# EAGLE design midi_to_cv (EAGLE 7.1.0)
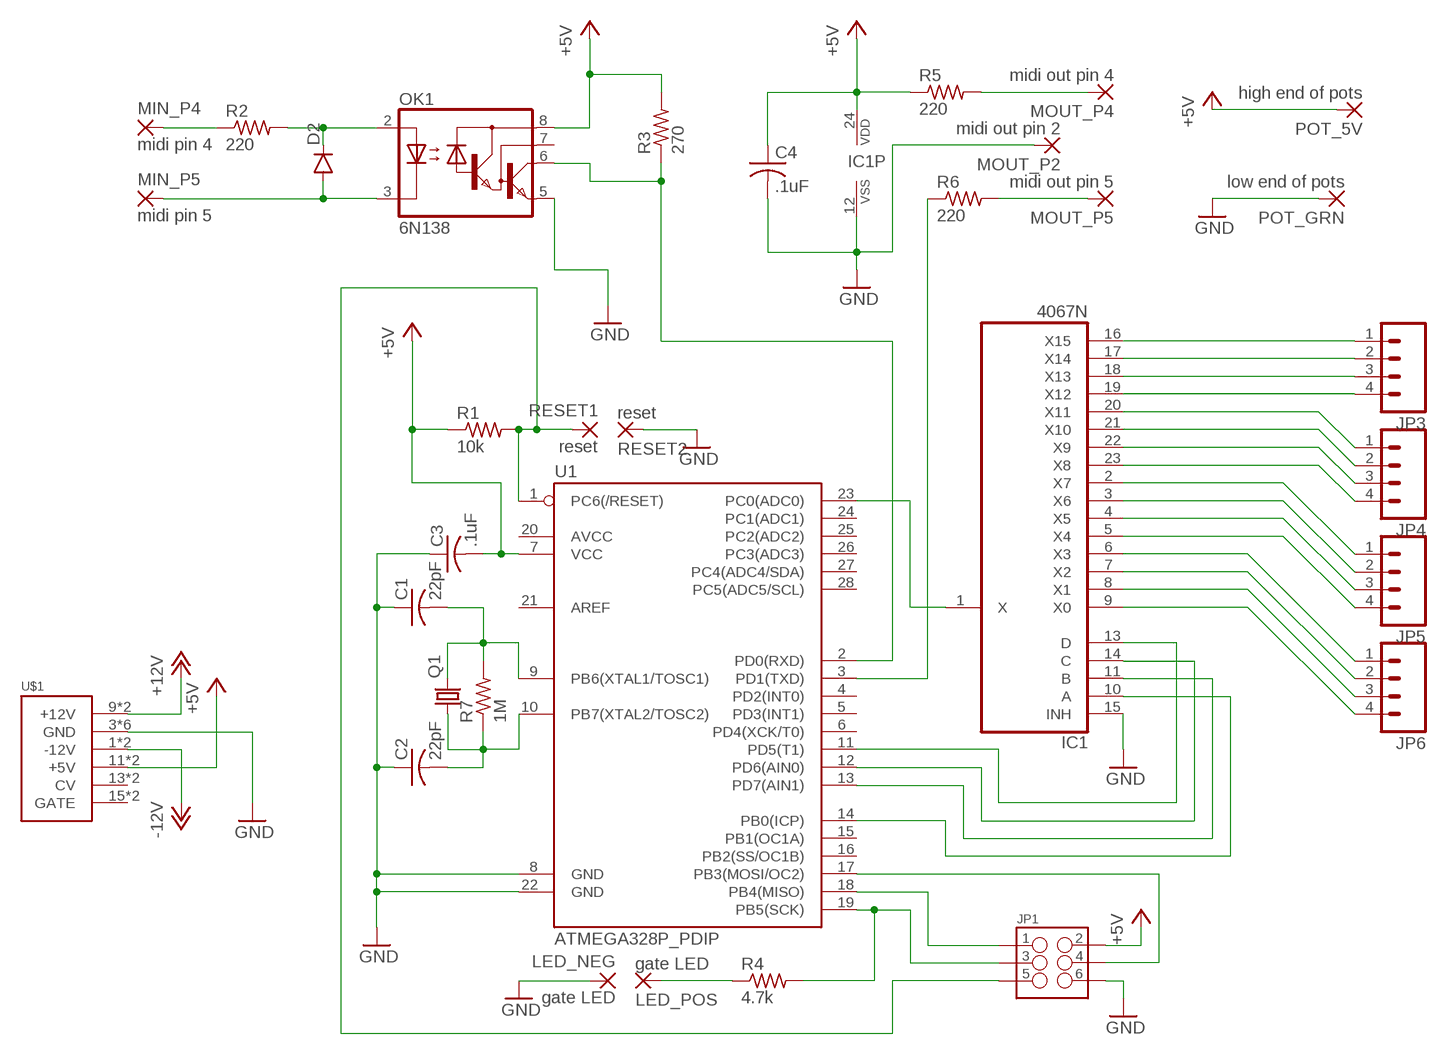
[diagram p0: schematic, sheet 1]

## Parts
C1  22pF  C-US025-040X050  [C025-040X050]
C2  22pF  C-US025-040X050  [C025-040X050]
C3  .1uF  C-US025-040X050  [C025-040X050]
C4  .1uF  C-US025-040X050  [C025-040X050]
D2  DIODE1N4148  [DIODE-1N4148]
IC1  4067N  [DIL24-6]
JP1  M03X2NO_SILK  [2X3-NS]
JP3  M04LONGPADS  [1X04_LONGPADS]
JP4  M04LONGPADS  [1X04_LONGPADS]
JP5  M04LONGPADS  [1X04_LONGPADS]
JP6  M04LONGPADS  [1X04_LONGPADS]
LED_NEG  gate LED  2,54/0,9  [2,54/0,9]
LED_POS  gate LED  2,54/0,9  [2,54/0,9]
MIN_P4  midi pin 4  2,54/0,9  [2,54/0,9]
MIN_P5  midi pin 5  2,54/0,9  [2,54/0,9]
MOUT_P2  midi out pin 2  2,54/0,9  [2,54/0,9]
MOUT_P4  midi out pin 4  2,54/0,9  [2,54/0,9]
MOUT_P5  midi out pin 5  2,54/0,9  [2,54/0,9]
OK1  6N138  [DIL08]
POT_5V  high end of pots  2,54/0,9  [2,54/0,9]
POT_GRN  low end of pots  2,54/0,9  [2,54/0,9]
Q1  CRYSTALHC49U-V  [HC49U-V]
R1  10k  R-US_0207/10  [0207/10]
R2  220  R-US_0207/10  [0207/10]
R3  270  R-US_0207/10  [0207/10]
R4  4.7k  R-US_0207/10  [0207/10]
R5  220  R-US_0207/10  [0207/10]
R6  220  R-US_0207/10  [0207/10]
R7  1M  R-US_0207/10  [0207/10]
RESET1  reset  2,54/0,9  [2,54/0,9]
RESET2  reset  2,54/0,9  [2,54/0,9]
U1  ATMEGA328P_PDIP  [DIL28-3]
U$1  POWER  [POWER_16]

## Nets
+5V: C3.2 C4.1 IC1.24(VDD) JP1.2 OK1.8(VCC) POT_5V.1(P) R1.1 R3.2 R5.1 U1.7(VCC) U$1.11(+5V) U$1.12(+5V)
+12V: U$1.9(+12V) U$1.10(+12V)
-12V: U$1.1(-12V) U$1.2(-12V)
GND: C1.1 C2.1 C3.1 C4.2 IC1.12(VSS) IC1.15(INH) JP1.6 LED_NEG.1(P) MOUT_P2.1(P) OK1.5(GND) POT_GRN.1(P) RESET2.1(P) U1.8(GND) U1.22(GND) U$1.3(GND) U$1.4(GND) U$1.5(GND) U$1.6(GND) U$1.7(GND) U$1.8(GND)
N$1: JP1.5 R1.2 RESET1.1(P) U1.1(PC6(/RESET))
N$2: IC1.9(X0) JP6.4
N$3: IC1.8(X1) JP6.3
N$4: C1.2 Q1.2 R7.2 U1.9(PB6(XTAL1/TOSC1))
N$5: C2.2 Q1.1 R7.1 U1.10(PB7(XTAL2/TOSC2))
N$6: MOUT_P5.1(P) R6.2
N$7: IC1.7(X2) JP6.2
N$8: IC1.6(X3) JP6.1
N$9: IC1.13(D) U1.11(PD5(T1))
N$10: JP1.3 R4.2 U1.19(PB5(SCK))
N$11: LED_POS.1(P) R4.1
N$12: IC1.14(C) U1.12(PD6(AIN0))
N$13: IC1.11(B) U1.13(PD7(AIN1))
N$14: IC1.10(A) U1.14(PB0(ICP))
N$15: IC1.5(X4) JP5.4
N$16: R6.1 U1.3(PD1(TXD))
N$17: IC1.4(X5) JP5.3
N$18: IC1.1(X) U1.23(PC0(ADC0))
N$19: IC1.3(X6) JP5.2
N$20: IC1.2(X7) JP5.1
N$21: IC1.23(X8) JP4.4
N$22: IC1.22(X9) JP4.3
N$23: IC1.21(X10) JP4.2
N$24: IC1.20(X11) JP4.1
N$25: IC1.19(X12) JP3.4
N$26: IC1.18(X13) JP3.3
N$27: IC1.17(X14) JP3.2
N$28: IC1.16(X15) JP3.1
N$29: D2.A MIN_P5.1(P) OK1.3(C)
N$30: D2.C OK1.2(A) R2.2
N$31: MIN_P4.1(P) R2.1
N$32: OK1.6(VO) R3.1 U1.2(PD0(RXD))
N$33: MOUT_P4.1(P) R5.2
N$34: JP1.4 U1.17(PB3(MOSI/OC2))
N$36: JP1.1 U1.18(PB4(MISO))
Unconnected: OK1.7(VB) U1.4(PD2(INT0)) U1.5(PD3(INT1)) U1.6(PD4(XCK/T0)) U1.15(PB1(OC1A)) U1.16(PB2(SS/OC1B)) U1.20(AVCC) U1.21(AREF) U1.24(PC1(ADC1)) U1.25(PC2(ADC2)) U1.26(PC3(ADC3)) U1.27(PC4(ADC4/SDA)) U1.28(PC5(ADC5/SCL)) U$1.13(CV) U$1.14(CV) U$1.15(GATE) U$1.16(GATE)

## Library data of the parts
C1-C4 = rcl:C-US: CAPACITOR, American symbol
D2 = SparkFun-DiscreteSemi:DIODE: Diode These are standard reverse protection diodes and small signal diodes. SMA package can handle up to about 1A. SOD-323 can handle about 200mA. What the SOD-323 package when ordering, there are some mfgs out there that are 5-pin packages.
IC1 = 40xx:4067: 16-channel ANALOG MULTIPLEXER
JP1 = SparkFun-Connectors:M03X2: 2x3 .1" header. Shrouded, with keying- CONN-10681 SMT- CONN-11415 Pogo pins- HW-11044
JP3-JP6 = SparkFun-Connectors:M04: Header 4 Standard 4-pin 0.1" header. Use with straight break away headers (SKU : PRT-00116), right angle break away headers (PRT-00553), swiss pins (PRT-00743), machine pins (PRT-00117), and female headers (PRT-00115). Molex polarized connector foot print use with SKU : PRT-08231 with associated crimp pins and housings. 1MM SMD Version SKU: PRT-10208
LED_NEG LED_POS MIN_P4 MIN_P5 MOUT_P2 MOUT_P4 MOUT_P5 POT_5V POT_GRN RESET1 RESET2 = wirepad:2,54/0,9: THROUGH-HOLE PAD
OK1 = optocoupler:6N138: MOTOROLA OPTO COUPLER; MF: VISHAY/TELEFUNKEN; MPN: 6N138; OC_FARNELL: 9860150; OC_NEWARK: 35K5294
Q1 = crystal:CRYSTAL: CRYSTAL; OC_FARNELL: 1666969; OC_NEWARK: unknown
R1-R7 = rcl:R-US_: RESISTOR, American symbol
U1 = SparkFun-DigitalIC:ATMEGA328P_PDIP: uC used in the Arduino 32kb flash, 1k EEPROM, 2k SRAM This is the through-hole version of this chip.
U$1 = eurorack:POWER

## Board
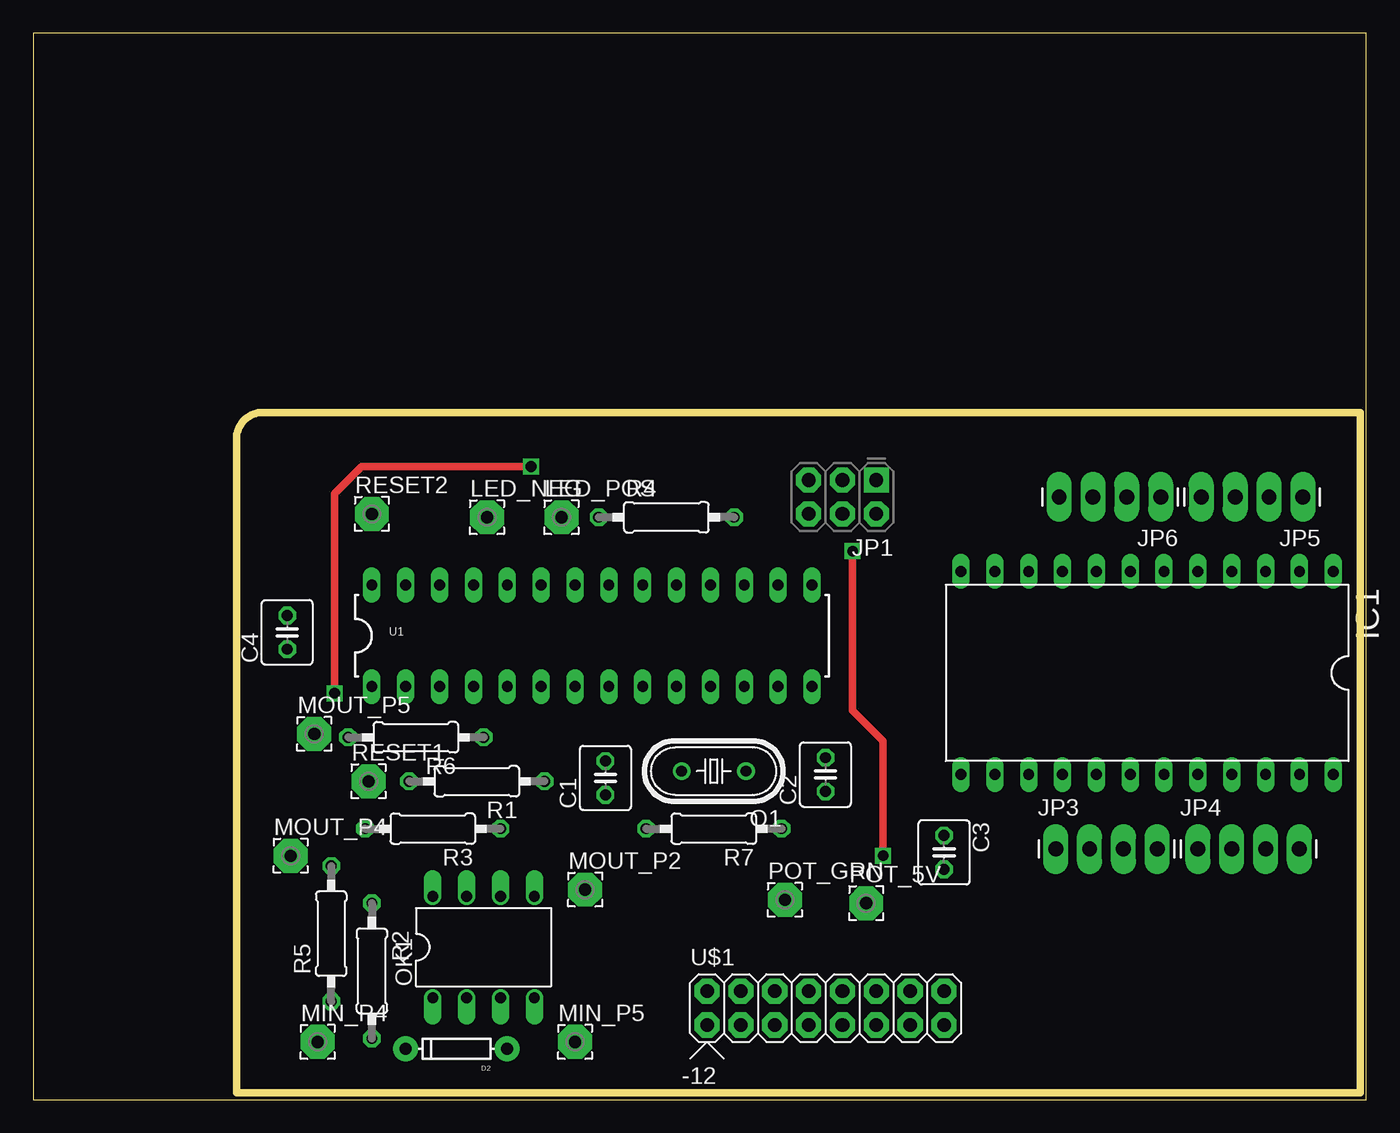
[diagram p1: board, top side]
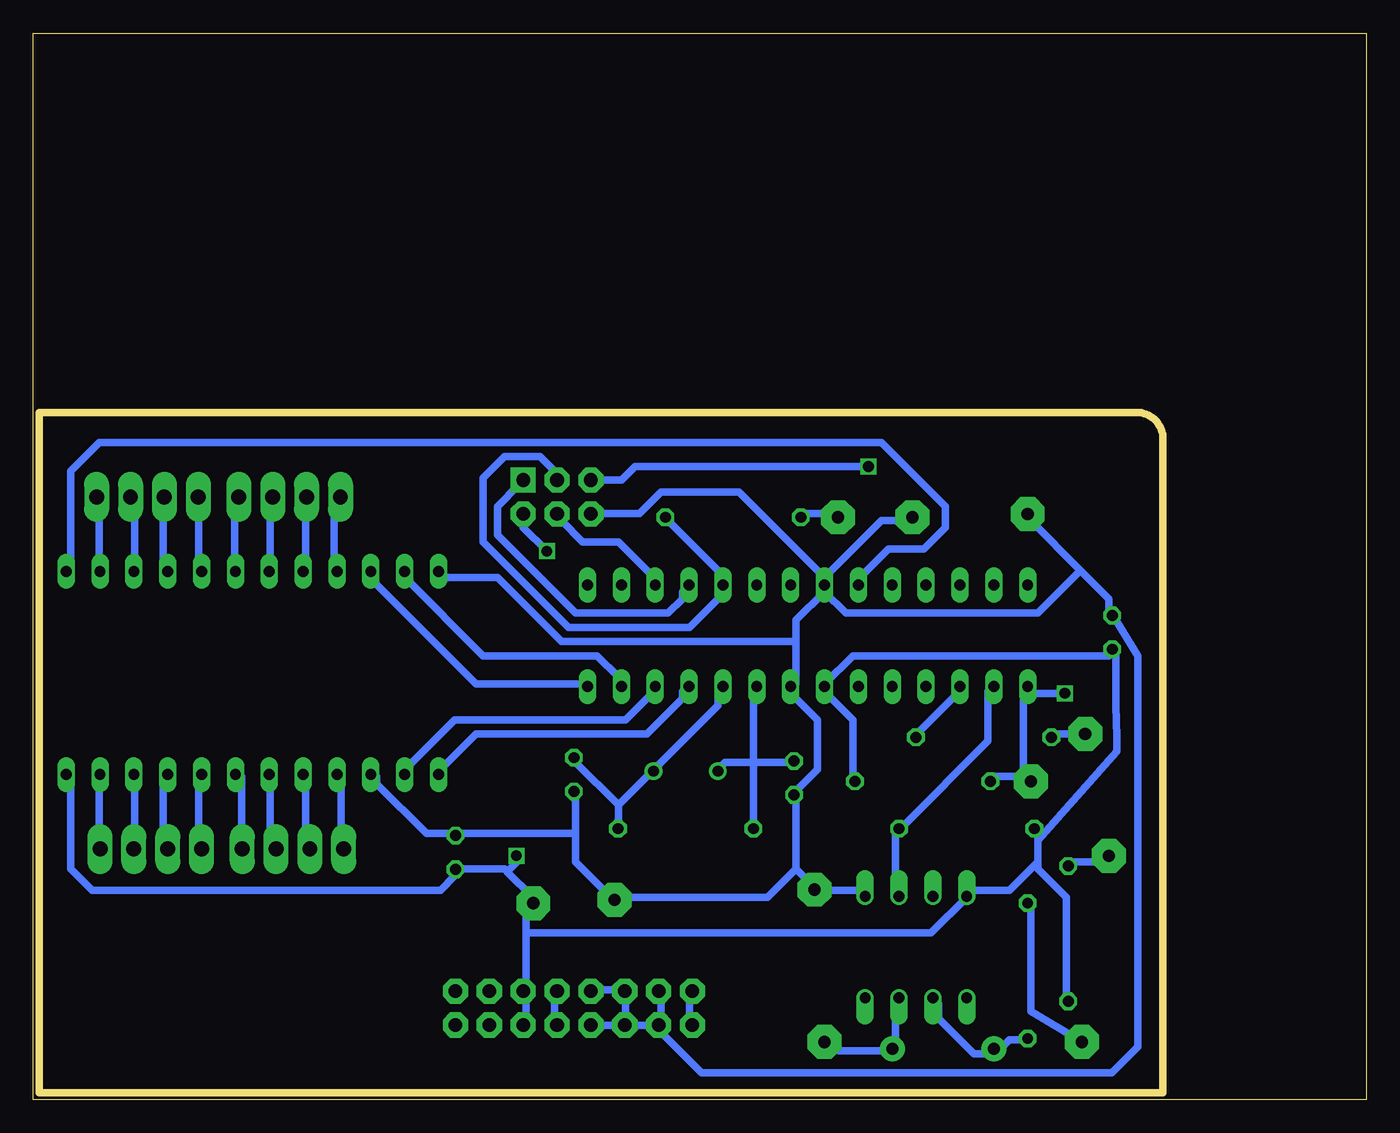
[diagram p2: board, bottom side, seen from below]

Size 100 x 80 mm. Coordinates in mm from the lower left corner, seen from the top.
Outline: 0,0 100,0 100,80 0,80 0,0
Copper layers (1*16): Top 0.035mm / dielectric 1.5mm / Bottom 0.035mm
Design rules "default *": minimum track width 22mil, minimum drill 24mil, track to track 20mil, track to pad 20mil, pad to pad 20mil, via to via 20mil, smd to smd 8mil, copper to edge 0mil, drill to drill 16mil, minimum pad ring 10mil, minimum via ring 8mil, stop-mask expansion 4mil, vias tented up to drill 0mil, thermal gap 10mil
Milling: 5 lines

### Footprints (pad centres in the part's own frame; a part is rotated, then mirrored left to right if it is on the bottom)
C025-040X050 = drill 0.813 octagon: 1 -1.27,0; 2 1.27,0
DIODE-1N4148 = drill 0.9 pad 1.88: A -3.81,0; C 3.81,0
DIL24-6 = drill 0.813 long: 1 -13.97,-7.62; 2 -11.43,-7.62; 3 -8.89,-7.62; 4 -6.35,-7.62; 5 -3.81,-7.62; 6 -1.27,-7.62; 7 1.27,-7.62; 8 3.81,-7.62; 9 6.35,-7.62; 10 8.89,-7.62; 11 11.43,-7.62; 12 13.97,-7.62; 13 13.97,7.62; 14 11.43,7.62; 15 8.89,7.62; 16 6.35,7.62; 17 3.81,7.62; 18 1.27,7.62; 19 -1.27,7.62; 20 -3.81,7.62; 21 -6.35,7.62; 22 -8.89,7.62; 23 -11.43,7.62; 24 -13.97,7.62
2X3-NS = drill 1.016 pad 1.88 square: 1 -2.54,-1.27 | drill 1.016 pad 1.88 octagon: 2 -2.54,1.27; 3 0,-1.27; 4 0,1.27; 5 2.54,-1.27; 6 2.54,1.27
1X04_LONGPADS = drill 1.118 pad 1.88 long: 1 0,0; 2 2.54,0; 3 5.08,0; 4 7.62,0
2,54/0,9 = drill 0.914 pad 2.54 octagon: 1 0,0
DIL08 = drill 0.813 offset: 1 -3.81,-3.81; 2 -1.27,-3.81; 3 1.27,-3.81; 4 3.81,-3.81; 5 3.81,3.81; 6 1.27,3.81; 7 -1.27,3.81; 8 -3.81,3.81
HC49U-V = drill 0.813: 1 -2.413,0; 2 2.413,0
0207/10 = drill 0.813 octagon: 1 -5.08,0; 2 5.08,0
DIL28-3 = drill 0.813 long: 1 -16.51,-3.81; 2 -13.97,-3.81; 3 -11.43,-3.81; 4 -8.89,-3.81; 5 -6.35,-3.81; 6 -3.81,-3.81; 7 -1.27,-3.81; 8 1.27,-3.81; 9 3.81,-3.81; 10 6.35,-3.81; 11 8.89,-3.81; 12 11.43,-3.81; 13 13.97,-3.81; 14 16.51,-3.81; 15 16.51,3.81; 16 13.97,3.81; 17 11.43,3.81; 18 8.89,3.81; 19 6.35,3.81; 20 3.81,3.81; 21 1.27,3.81; 22 -1.27,3.81; 23 -3.81,3.81; 24 -6.35,3.81; 25 -8.89,3.81; 26 -11.43,3.81; 27 -13.97,3.81; 28 -16.51,3.81
POWER_16 = drill 1.016 pad 1.88 octagon: 1 -6.35,-1.27; 2 -6.35,1.27; 3 -3.81,-1.27; 4 -3.81,1.27; 5 -1.27,-1.27; 6 -1.27,1.27; 7 1.27,-1.27; 8 1.27,1.27; 9 3.81,-1.27; 10 3.81,1.27; 11 6.35,-1.27; 12 6.35,1.27; 13 8.89,-1.27; 14 8.89,1.27; 15 11.43,-1.27; 16 11.43,1.27

### Placement (x,y rotation side)
C1  42.93,24.13 90 top
C2  59.44,24.38 90 top
C3  68.33,18.54 270 top
C4  19.05,35.05 90 top
D2  31.75,3.81 180 top
IC1  83.57,32 180 top
JP1  60.71,45.21 180 top
JP3  76.71,18.8 0 top
JP4  87.38,18.8 0 top
JP5  95.25,45.21 180 top
JP6  84.58,45.21 180 top
LED_NEG  34.04,43.69 0 top
LED_POS  39.62,43.69 0 top
MIN_P4  21.34,4.32 0 top
MIN_P5  40.64,4.32 0 top
MOUT_P2  41.4,15.75 0 top
MOUT_P4  19.3,18.29 0 top
MOUT_P5  21.08,27.43 0 top
OK1  33.78,11.43 0 top
POT_5V  62.48,14.73 0 top
POT_GRN  56.39,14.99 0 top
Q1  51.05,24.64 180 top
R1  33.27,23.88 180 top
R2  25.4,9.65 270 top
R3  29.97,20.32 180 top
R4  47.5,43.69 0 top
R5  22.35,12.45 90 top
R6  28.7,27.18 180 top
R7  51.05,20.32 180 top
RESET1  25.15,23.88 0 top
RESET2  25.4,43.94 0 top
U1  41.91,34.8 0 top
U$1  56.9,6.86 0 top

### Tracks (layer width: path | path; a pad name or v marks a point on that pad's centre or on a via)
+5V  (via drill 0.8)
  Top 0.559: v61.47,41.15 61.47,29.21 63.75,26.92 v63.75,18.29
  Bottom 0.559: R1.1 38.51,24.23 38.51,28.5 40.64,30.63 U1.7 40.64,31.17 38.51,33.3 19.3,33.3 C4.1 18.77,33.3 18.77,29.57 18.69,27.2 18.69,26.14 24.64,19.43 | 24.64,19.43 24.64,19.96 R3.2 | 24.64,19.43 24.64,17.83 | 24.64,17.83 24.64,17.3 22.5,15.16 22.5,7.7 R5.1 | 24.64,17.83 26.77,15.7 29.97,15.7 OK1.8 29.97,15.16 32.64,12.5 63.04,12.5 | U$1.11 63.04,6.1 63.04,7.7 U$1.12 63.04,8.23 63.04,12.5 | 64.44,17.09 62.51,15.16 POT_5V.1 62.51,14.63 63.04,14.1 63.04,12.5 | 64.44,17.09 64.64,17.3 67.84,17.3 C3.2 68.38,16.76 69.44,15.7 95.58,15.7 97.18,17.3 97.18,24.23 IC1.24 | JP1.2 63.25,42.93 v61.47,41.15 | v63.75,18.29 63.75,17.78 64.44,17.09
+12V
  Bottom 0.559: U$1.9 60.91,6.1 60.91,7.7 U$1.10
-12V
  Bottom 0.559: U$1.1 50.77,6.1 50.77,7.7 U$1.2
GND
  Bottom 0.559: 59.31,19.96 59.31,17.83 56.64,15.16 POT_GRN.1 56.11,15.16 44.91,15.16 42.77,17.3 | 59.31,19.96 59.31,22.63 C2.1 | 59.31,19.96 67.84,19.96 C3.1 68.38,19.96 70.51,19.96 74.24,23.7 74.24,24.23 IC1.15 | OK1.5 37.97,15.7 41.17,15.7 MOUT_P2.1 41.71,16.23 42.77,17.3 | 42.77,17.3 42.77,22.63 C1.1 42.77,23.16 41.17,24.77 41.17,28.5 43.31,30.63 U1.8 42.77,31.17 42.77,34.37 | 42.77,34.37 42.77,35.97 40.64,38.1 | 42.77,34.37 60.38,34.37 65.18,39.17 69.44,39.17 IC1.12 | 40.64,39.17 47.04,45.57 52.91,45.57 54.51,43.97 57.71,43.97 JP1.6 | U1.22 40.64,39.17 | 40.64,39.17 36.37,43.43 34.24,43.43 LED_NEG.1 | 40.64,38.63 U1.22 | U$1.8 57.71,8.23 56.11,8.23 U$1.6 55.58,7.7 55.58,6.1 U$1.5 | U$1.3 52.91,6.1 52.91,7.7 U$1.4 | U$1.5 56.11,5.56 57.71,5.56 U$1.7 | U$1.3 53.44,5.56 55.58,5.56 U$1.5 | 21.44,39.7 25.17,43.43 RESET2.1 | 21.44,39.7 19.3,37.57 19.3,36.5 C4.2 18.77,35.97 17.12,33.3 17.12,3.96 19.07,2.01 49.89,2.01 52.91,5.03 52.91,5.56 U$1.3 | 40.64,38.1 39.04,36.5 24.64,36.5 21.44,39.7 | 40.64,38.1 U1.22
N$1  (via drill 0.8)
  Top 0.559: v37.34,47.5 24.64,47.5 22.61,45.47 v22.61,30.48
  Bottom 0.559: 25.7,24.23 25.17,24.23 RESET1.1 25.7,24.23 | 25.7,24.23 27.84,24.23 R1.2 | 25.7,24.23 25.7,30.48 | 25.7,30.48 25.7,30.63 U1.1 | JP1.5 55.88,46.48 54.86,47.5 v37.34,47.5 | v22.61,30.48 25.7,30.48
N$2
  Bottom 0.559: IC1.9 77.44,39.7 77.44,45.03 JP6.4
N$3
  Bottom 0.559: IC1.8 79.58,39.7 79.58,45.03 JP6.3
N$4
  Bottom 0.559: 45.97,25.3 48.11,25.3 48.64,24.77 Q1.2 | 45.97,25.3 43.31,25.3 C1.2 | 45.97,25.3 45.97,30.63 U1.9 | 45.97,25.3 R7.2
N$5
  Bottom 0.559: 56.11,22.1 56.11,20.5 R7.1 | 56.11,22.1 53.98,24.23 Q1.1 53.44,24.77 48.64,29.57 48.64,30.63 U1.10 | 56.11,22.1 59.31,25.3 C2.2
N$6
  Bottom 0.559: MOUT_P5.1 23.57,27.43 R6.2
N$7
  Bottom 0.559: IC1.7 82.25,39.7 82.25,45.03 JP6.2
N$8
  Bottom 0.559: IC1.6 84.91,39.7 84.91,45.03 JP6.1
N$9
  Bottom 0.559: U1.11 51.31,30.63 51.31,30.1 53.98,27.43 66.78,27.43 69.44,24.77 IC1.13
N$10
  Bottom 0.559: R4.2 52.38,43.43 48.64,39.7 48.64,38.63 U1.19 48.11,38.1 50.77,35.43 59.84,35.43 66.24,41.83 66.24,46.63 64.64,48.23 61.98,48.23 60.91,47.17 60.91,46.63 JP1.3
N$11
  Bottom 0.559: R4.1 42.24,43.97 40.11,43.97 LED_POS.1
N$12
  Bottom 0.559: IC1.14 72.11,24.77 68.38,28.5 55.58,28.5 53.44,30.63 U1.12
N$13
  Bottom 0.559: U1.13 56.11,31.17 56.11,31.7 57.71,33.3 66.24,33.3 72.11,39.17 IC1.11
N$14
  Bottom 0.559: U1.14 58.78,31.17 66.78,31.17 74.78,39.17 IC1.10
N$15
  Bottom 0.559: IC1.5 87.58,39.7 87.58,45.03 JP5.4
N$16
  Bottom 0.559: U1.3 30.5,30.63 33.71,27.43 R6.1
N$17
  Bottom 0.559: IC1.4 90.25,39.7 90.25,45.03 JP5.3
N$18
  Bottom 0.559: U1.23 37.97,38.63 37.97,39.17 35.84,41.3 33.17,41.3 31.57,42.9 31.57,44.5 36.37,49.3 95.05,49.3 97.18,47.17 97.18,39.7 IC1.1
N$19
  Bottom 0.559: IC1.3 92.38,39.7 92.38,45.03 JP5.2
N$20
  Bottom 0.559: IC1.2 95.05,39.7 95.05,45.03 JP5.1
N$21
  Bottom 0.559: IC1.23 95.05,24.23 95.05,18.9 JP4.4
N$22
  Bottom 0.559: IC1.22 92.38,24.23 92.38,18.9 JP4.3
N$23
  Bottom 0.559: IC1.21 90.25,24.23 90.25,18.9 JP4.2
N$24
  Bottom 0.559: IC1.20 87.58,24.23 87.58,18.9 JP4.1
N$25
  Bottom 0.559: IC1.19 84.38,24.23 84.38,18.9 JP3.4
N$26
  Bottom 0.559: IC1.18 82.25,24.23 82.25,18.9 JP3.3
N$27
  Bottom 0.559: IC1.17 79.58,24.23 79.58,18.9 JP3.2
N$28
  Bottom 0.559: IC1.16 76.91,24.23 76.91,18.9 JP3.1
N$29
  Bottom 0.559: OK1.3 35.31,7.16 35.31,3.43 D2.A 35.84,3.66 39.57,3.66 MIN_P5.1
N$30
  Bottom 0.559: R2.2 25.7,4.5 26.77,4.5 27.84,3.43 D2.C 28.37,3.43 29.44,3.43 32.11,6.1 32.11,7.16 OK1.2
N$31
  Bottom 0.559: MIN_P4.1 25.17,6.63 25.17,14.63 R2.1
N$32
  Bottom 0.559: OK1.6 35.31,15.7 35.31,19.96 R3.1 34.77,20.5 28.37,26.9 28.37,30.63 U1.2
N$33
  Bottom 0.559: R5.2 21.97,17.83 19.3,17.83 MOUT_P4.1
N$34
  Bottom 0.559: U1.17 53.44,38.63 53.44,39.17 56.11,41.83 58.78,41.83 60.38,43.43 JP1.4
N$36
  Bottom 0.559: U1.18 51.31,38.1 51.31,37.57 52.38,36.5 59.31,36.5 65.18,42.37 65.18,44.5 63.58,46.1 JP1.1